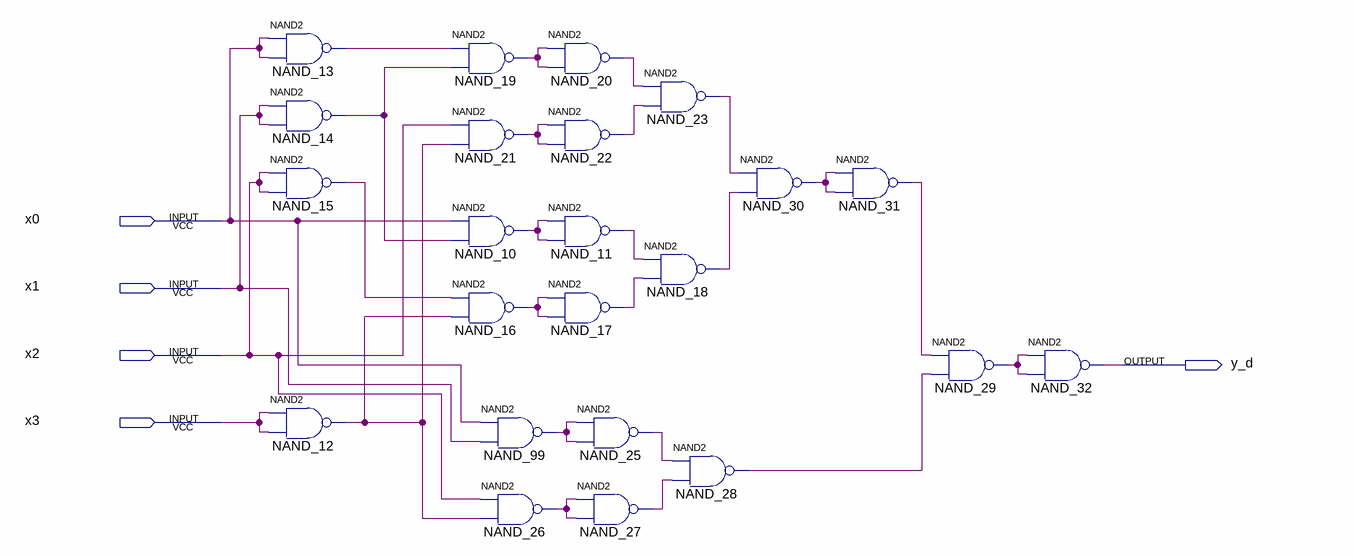
[diagram p0: schematic sheet]
// Quartus schematic d_schema.bdf as structural Verilog: 23 symbols, 5 pins
module d_schema (
  input  x0,
  input  x1,
  input  x2,
  input  x3,
  output y_d
);

  wire NAND_10_out, NAND_11_out, NAND_12_out, NAND_13_out, NAND_14_out, NAND_15_out, NAND_16_out,
       NAND_17_out, NAND_18_out, NAND_19_out, NAND_20_out, NAND_21_out, NAND_22_out, NAND_23_out,
       NAND_25_out, NAND_26_out, NAND_27_out, NAND_28_out, NAND_29_out, NAND_30_out, NAND_31_out, NAND_99_out;

  nand NAND_13 (NAND_13_out, x0, x0);
  nand NAND_14 (NAND_14_out, x1, x1);
  nand NAND_15 (NAND_15_out, x2, x2);
  nand NAND_12 (NAND_12_out, x3, x3);
  nand NAND_19 (NAND_19_out, NAND_13_out, NAND_14_out);
  nand NAND_21 (NAND_21_out, x2, NAND_12_out);
  nand NAND_10 (NAND_10_out, x0, NAND_14_out);
  nand NAND_16 (NAND_16_out, NAND_15_out, NAND_12_out);
  nand NAND_99 (NAND_99_out, x0, x1);
  nand NAND_26 (NAND_26_out, x2, NAND_12_out);
  nand NAND_20 (NAND_20_out, NAND_19_out, NAND_19_out);
  nand NAND_22 (NAND_22_out, NAND_21_out, NAND_21_out);
  nand NAND_11 (NAND_11_out, NAND_10_out, NAND_10_out);
  nand NAND_17 (NAND_17_out, NAND_16_out, NAND_16_out);
  nand NAND_25 (NAND_25_out, NAND_99_out, NAND_99_out);
  nand NAND_27 (NAND_27_out, NAND_26_out, NAND_26_out);
  nand NAND_23 (NAND_23_out, NAND_20_out, NAND_22_out);
  nand NAND_18 (NAND_18_out, NAND_11_out, NAND_17_out);
  nand NAND_28 (NAND_28_out, NAND_25_out, NAND_27_out);
  nand NAND_30 (NAND_30_out, NAND_23_out, NAND_18_out);
  nand NAND_31 (NAND_31_out, NAND_30_out, NAND_30_out);
  nand NAND_29 (NAND_29_out, NAND_31_out, NAND_28_out);
  nand NAND_32 (y_d, NAND_29_out, NAND_29_out);
endmodule
